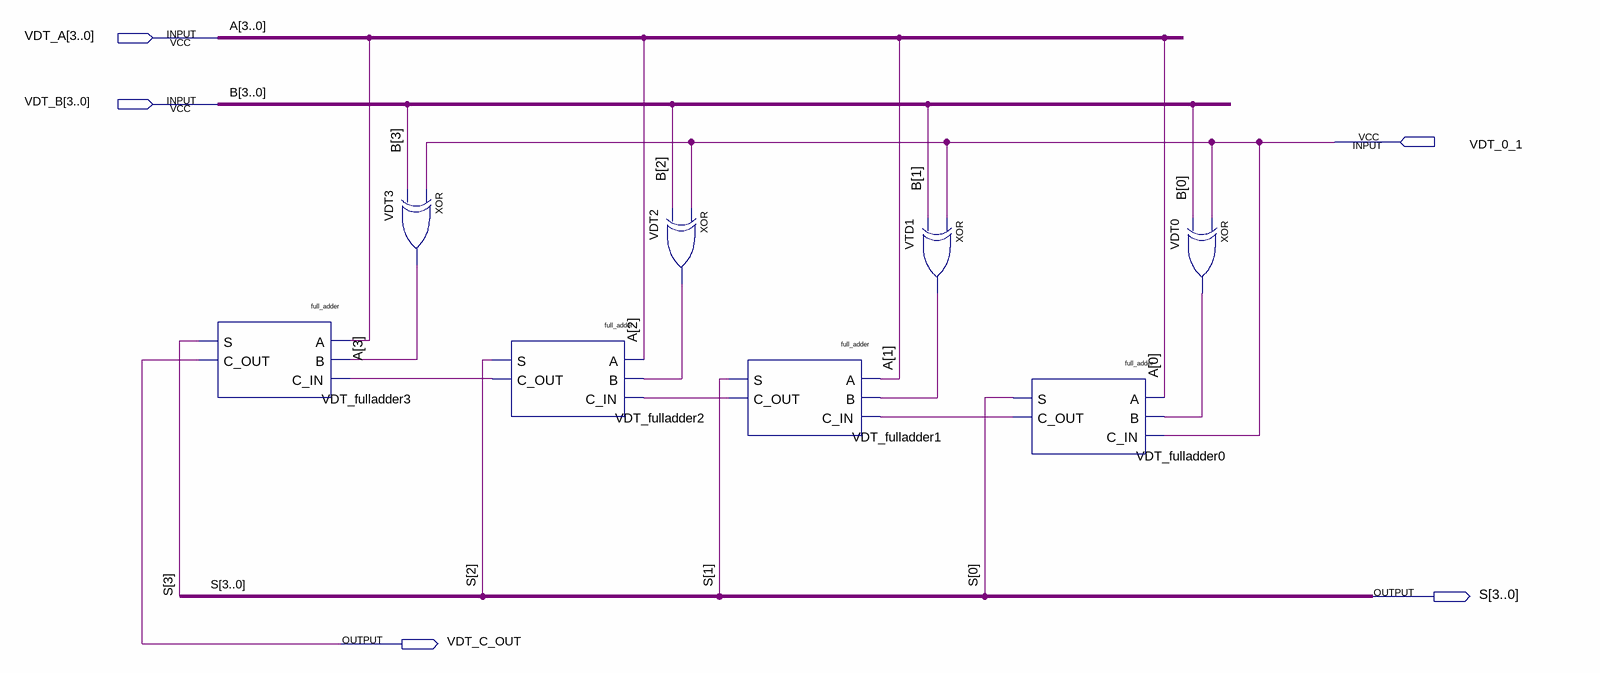
[diagram p0: schematic sheet]
// Quartus schematic Assignment2.bdf as structural Verilog: 8 symbols, 5 pins
module Assignment2 (
  input  [3:0] VDT_A,
  input  [3:0] VDT_B,
  input  VDT_0_1,
  output [3:0] S,
  output VDT_C_OUT
);

  wire VDT0_out, VDT2_out, VDT3_out, VDT_fulladder0_c_out, VDT_fulladder1_c_out, VDT_fulladder2_c_out,
       VTD1_out;

  full_adder VDT_fulladder3 (.A(VDT_A[3]), .B(VDT3_out), .C_IN(VDT_fulladder2_c_out), .S(S[3]), .C_OUT(VDT_C_OUT));
  xor VDT3 (VDT3_out, VDT_0_1, VDT_B[3]);
  full_adder VDT_fulladder2 (
    .A(VDT_A[2]), .B(VDT2_out), .C_IN(VDT_fulladder1_c_out), .S(S[2]), .C_OUT(VDT_fulladder2_c_out));
  xor VDT2 (VDT2_out, VDT_0_1, VDT_B[2]);
  full_adder VDT_fulladder1 (
    .A(VDT_A[1]), .B(VTD1_out), .C_IN(VDT_fulladder0_c_out), .S(S[1]), .C_OUT(VDT_fulladder1_c_out));
  xor VTD1 (VTD1_out, VDT_0_1, VDT_B[1]);
  full_adder VDT_fulladder0 (.A(VDT_A[0]), .B(VDT0_out), .C_IN(VDT_0_1), .S(S[0]), .C_OUT(VDT_fulladder0_c_out));
  xor VDT0 (VDT0_out, VDT_0_1, VDT_B[0]);

  // Other names for the same wires on the sheet: A[3:0] = VDT_A; B[3:0] = VDT_B
endmodule
